# EasyEDA Pro project keyboard_board_pcb.epro

# Board Keyboard_pcb
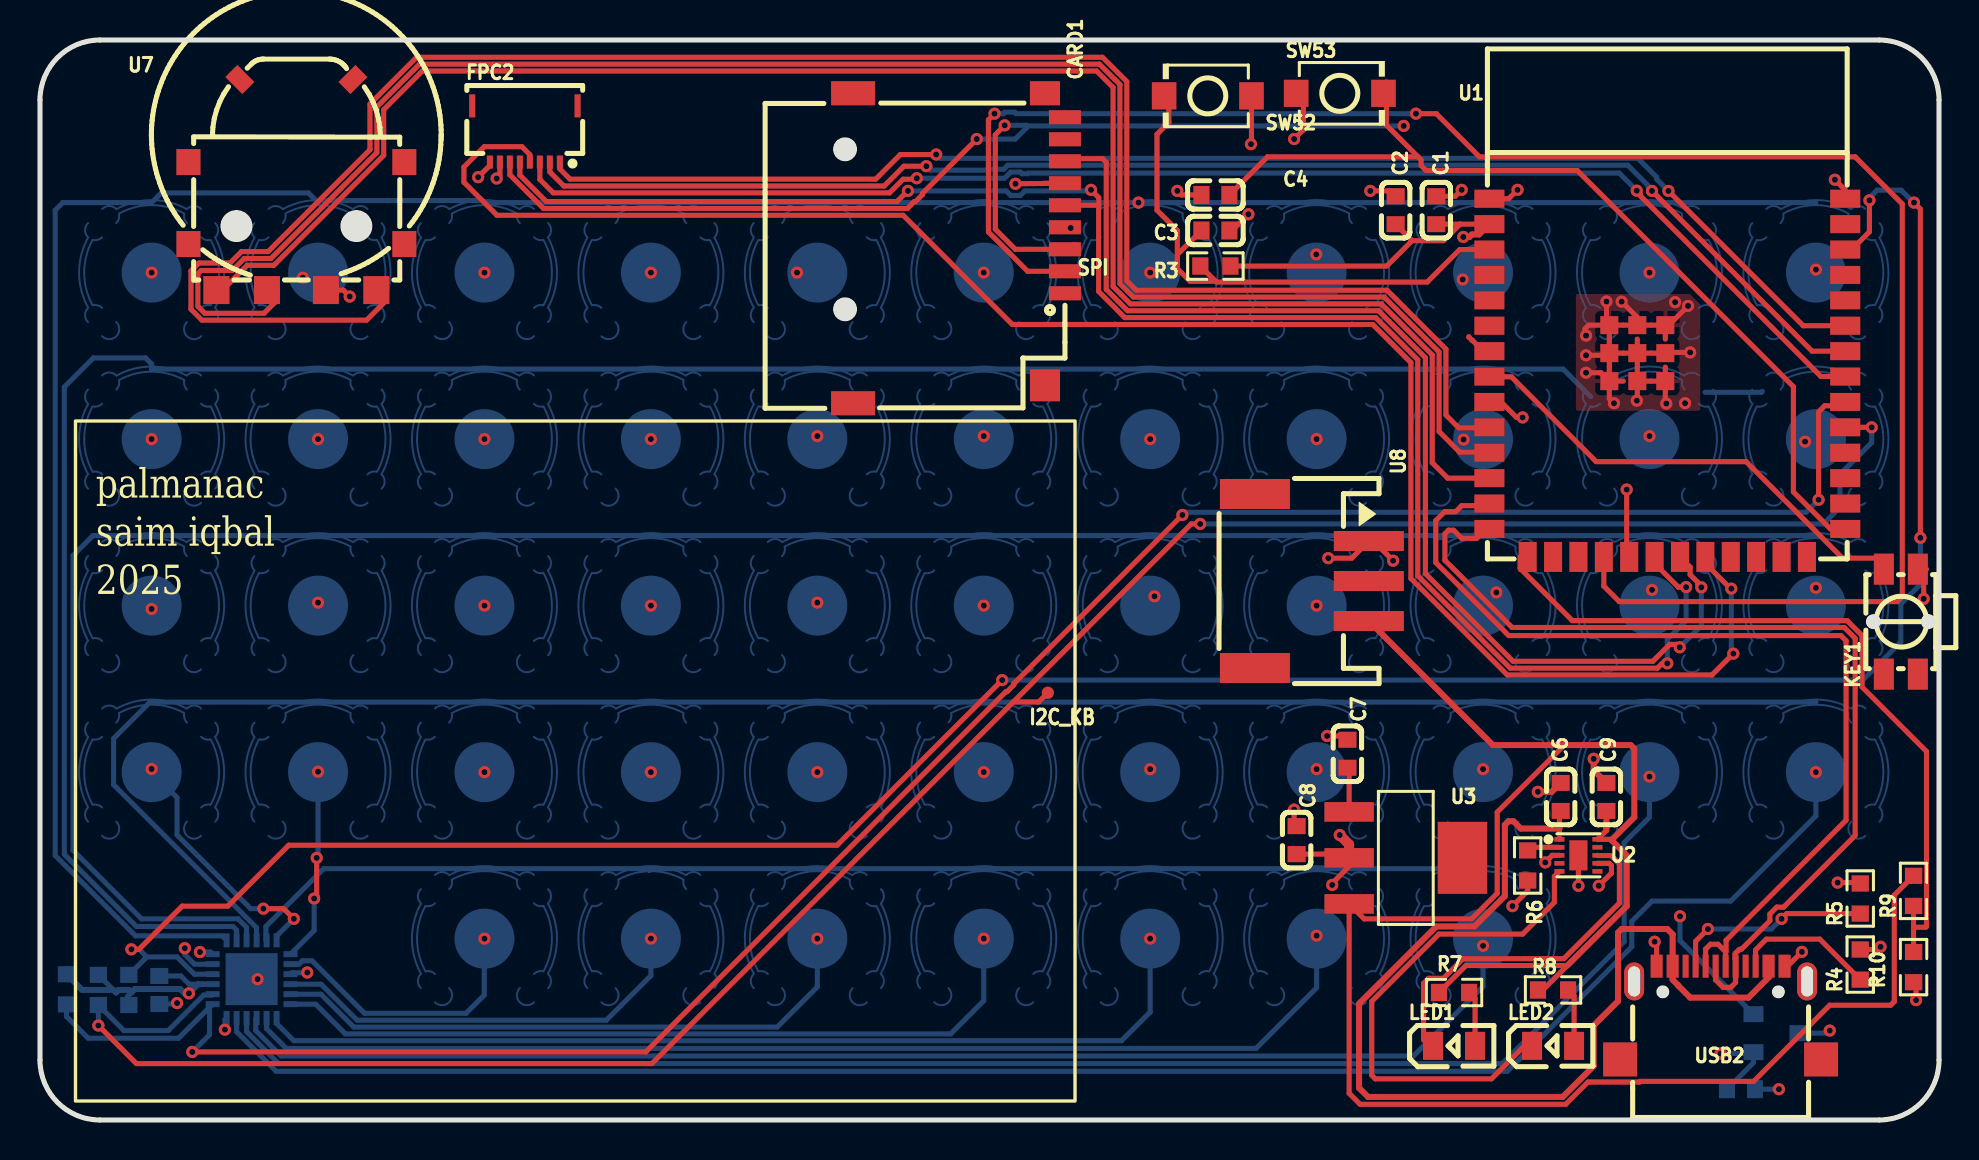
[diagram p0: board, top side]
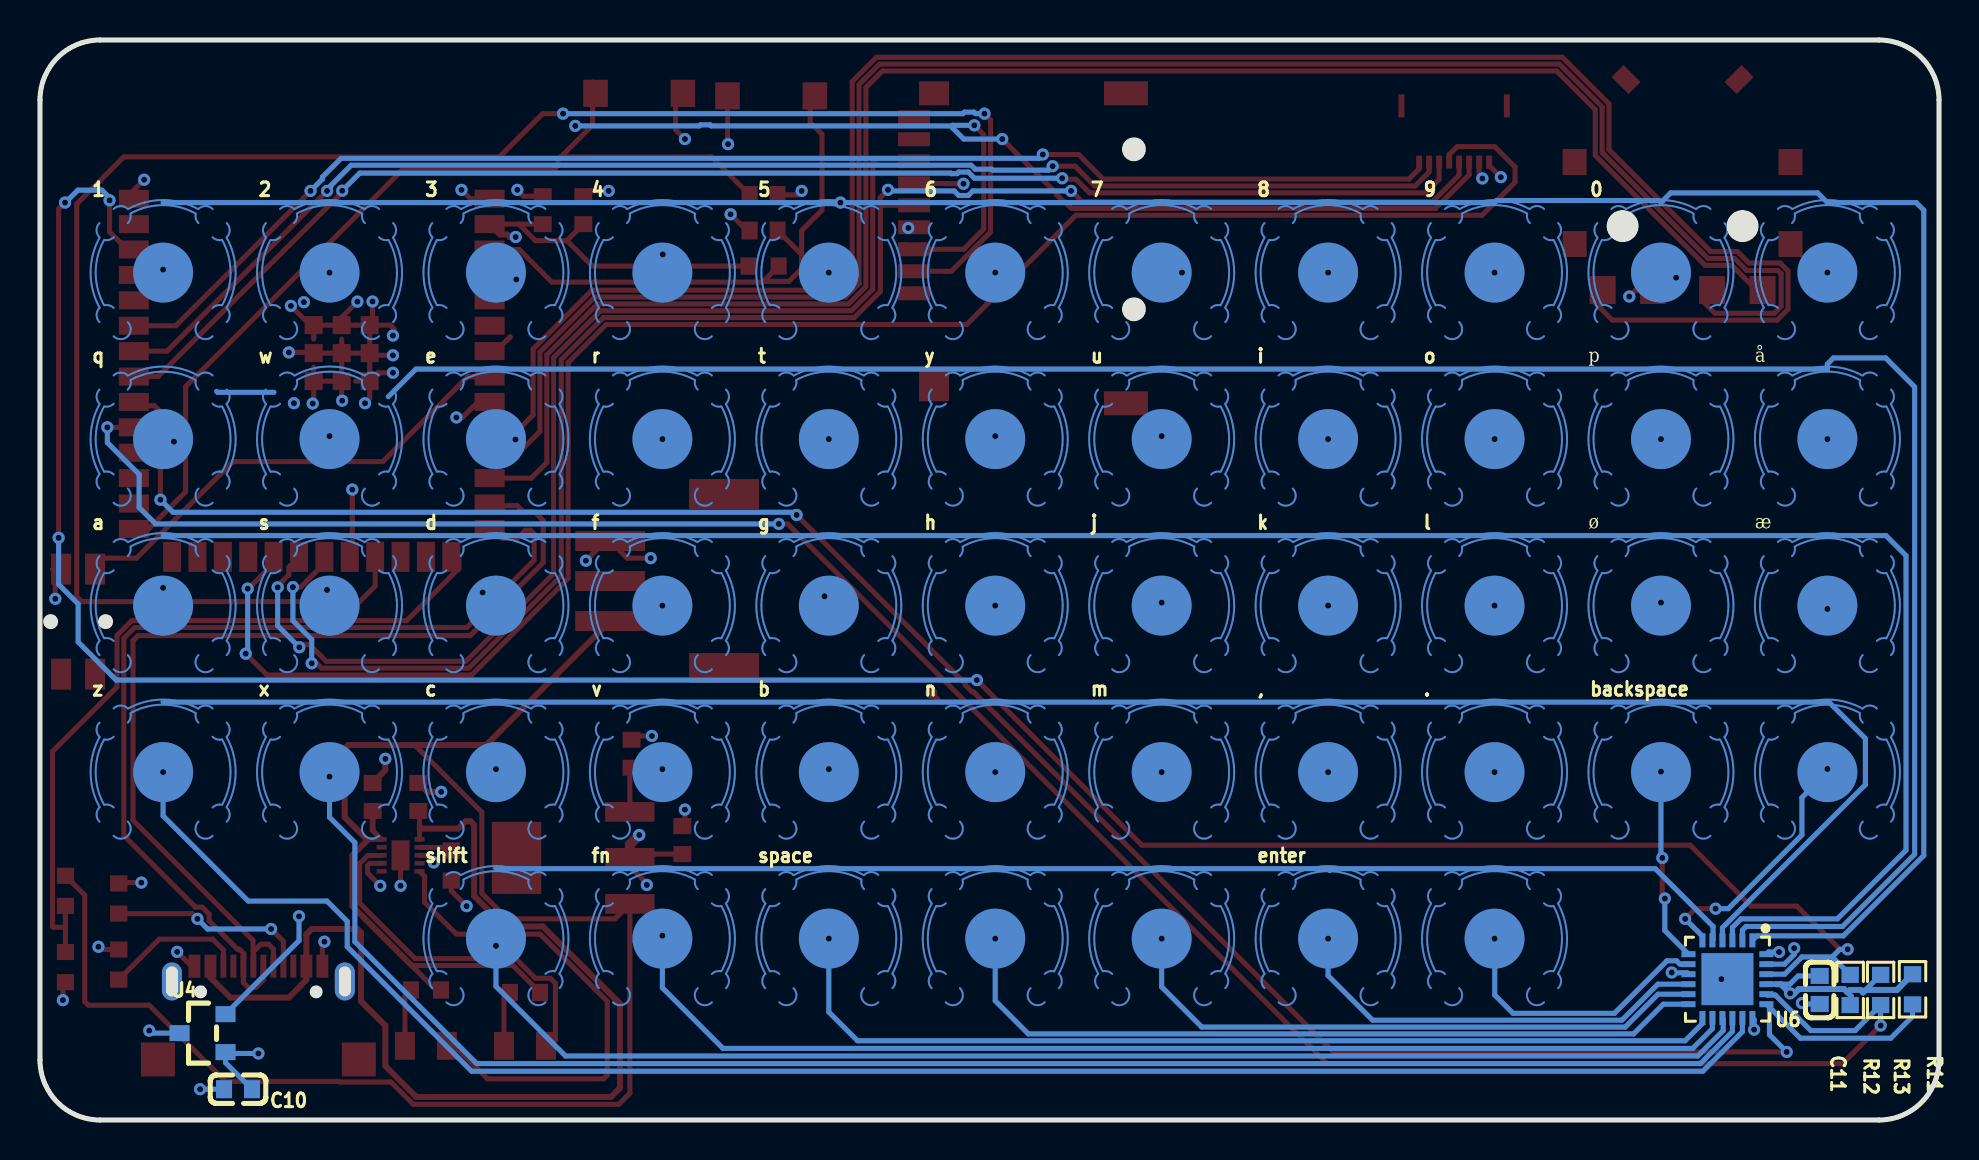
[diagram p1: board, bottom side, seen from below]

Outline 95 x 54 mm; copper layers: Top Layer, Inner1, Inner2, Bottom Layer. Coordinates in mm from the lower left corner of the outline.
Outline path: 0,51 0,3 arc(0.88,0.88) 3,0 92,0 arc(94.12,0.88) 95,3 95,51 arc(94.12,53.12) 92,54 3,54 arc(0.88,53.12) 0,51
Stack: Top Layer 0.035mm Outer layer thickness 1oz / Dielectric1 0.2104mm 7628 RC49% 8.6mil / Inner1 0.0152mm Inner layer thickness / Dielectric2 1.065mm 1.1mm H/HOZ Copper / Inner2 0.0152mm Inner layer thickness / Dielectric3 0.2104mm 7628 RC49% 8.6mil / Bottom Layer 0.035mm Outer layer thickness 1oz

## Design rules (mm)
net USB_D-: USB_D
net USB_D+: USB_D
template: Custom Config
spacing copperThicknessInner0.5oz (default): track to track 0.089, other pairs 0.152 to 0.3
spacing copperThickness1oz: track to track 0.102, other pairs 0.152 to 0.3
spacing copperThickness2oz: track to track 0.203, other pairs 0.152 to 0.3
track width copperThickness1oz: min 0.102, default 0.254, max 2.54
track width copperThickness0.5oz (default): min 0.089, default 0.254, max 2.54
track width copperThickness2oz: min 0.203, default 0.254, max 2.54
differential pair differentialPair (default): width min 0.127, default 0.254, max 2.54; gap min 0.152, default 0.152
via viaSize (default): diameter min 0.3, default 0.61, max 10; hole min 0.2, default 0.305, max 6.3

## Placement (name value [footprint] x y rotation side)
0  -  [Switch_Dome_7MM]  13.91 42.37 180 bottom
1  -  [Switch_Dome_7MM]  88.84 42.37 180 bottom
2  -  [Switch_Dome_7MM]  80.52 42.37 180 bottom
3  -  [Switch_Dome_7MM]  72.19 42.37 180 bottom
4  -  [Switch_Dome_7MM]  63.86 42.37 180 bottom
5  -  [Switch_Dome_7MM]  55.54 42.37 180 bottom
6  -  [Switch_Dome_7MM]  47.21 42.37 180 bottom
7  -  [Switch_Dome_7MM]  38.89 42.37 180 bottom
8  -  [Switch_Dome_7MM]  30.56 42.37 180 bottom
9  -  [Switch_Dome_7MM]  22.24 42.37 180 bottom
,  -  [Switch_Dome_7MM]  30.56 17.39 180 bottom
.  -  [Switch_Dome_7MM]  22.24 17.39 180 bottom
a  -  [Switch_Dome_7MM]  88.84 25.72 180 bottom
b  -  [Switch_Dome_7MM]  55.54 17.39 180 bottom
backspace  -  [Switch_Dome_7MM]  13.91 17.39 180 bottom
c  -  [Switch_Dome_7MM]  72.19 17.39 180 bottom
C1  100nF  [C0603]  69.85 45.49 90 top
C2  10uF  [C0603]  67.82 45.49 90 top
C3  100nF  [C0603]  58.8 44.47 0 top
C4  100nF  [C0603]  58.8 46.25 180 top
C6  1uF  [C0603]  76.07 16.15 90 top
C7  4.7uF  [C0603]  65.4 18.31 270 top
C8  4.7uF  [C0603]  62.86 13.99 270 top
C9  1uF  [C0603]  78.36 16.15 90 top
C10  10uF  [C0603]  85.09 1.54 0 bottom
C11  100nF  [C0603]  5.97 6.5 270 bottom
CARD1  TF PUSH  [TF-SMD_TF-PUSH]  45.97 43.59 270 top
d  -  [Switch_Dome_7MM]  72.19 25.72 180 bottom
e  -  [Switch_Dome_7MM]  72.19 34.05 180 bottom
enter  -  [Switch_Dome_7MM]  30.56 9.07 180 bottom
f  -  [Switch_Dome_7MM]  63.86 25.72 180 bottom
fn  -  [Switch_Dome_7MM]  63.86 9.07 180 bottom
FPC2  HC-FPC-05-10-8RLTAG  [FPC-SMD_8P-P0.50_HCTL_HC-FPC-05-10-8RLTAG]  24.26 49.3 0 top
g  -  [Switch_Dome_7MM]  55.54 25.72 180 bottom
h  -  [Switch_Dome_7MM]  47.21 25.72 180 bottom
i  -  [Switch_Dome_7MM]  30.56 34.05 180 bottom
j  -  [Switch_Dome_7MM]  38.89 25.72 180 bottom
k  -  [Switch_Dome_7MM]  30.56 25.72 180 bottom
KEY1  EVQPUL02K  [KEY-SMD_4P-L4.7-W3.5-P1.70-LS6.4-EH]  93.09 24.92 90 top
l  -  [Switch_Dome_7MM]  22.24 25.72 180 bottom
LED1  NCD0805R1  [LED0805-R-RD]  70.74 3.71 0 top
LED2  NCD0805R1  [LED0805-R-RD]  75.69 3.71 0 top
m  -  [Switch_Dome_7MM]  38.89 17.39 180 bottom
n  -  [Switch_Dome_7MM]  47.21 17.39 180 bottom
NOREF  -  [Pad_e786]  51.75 43.59 0 top
NOREF#2  -  [Pad_e787]  51.75 43.59 0 top
NOREF#3  -  [Pad_e778]  50.42 21.36 0 top
o  -  [Switch_Dome_7MM]  22.24 34.05 180 bottom
p  -  [Switch_Dome_7MM]  13.91 34.05 180 bottom
q  -  [Switch_Dome_7MM]  88.84 34.05 180 bottom
r  -  [Switch_Dome_7MM]  63.86 34.05 180 bottom
R3  10kΩ  [R0603]  58.8 42.7 180 top
R4  5.1kΩ  [R0603]  91.06 7.77 90 top
R5  5.1kΩ  [R0603]  91.06 11.07 90 top
R6  154Ω  [R0603]  74.42 12.72 90 top
R7  1.5kΩ  [R0603]  70.74 6.38 180 top
R8  1.5kΩ  [R0603]  75.69 6.5 180 top
R9  100kΩ  [R0603]  93.73 11.45 90 top
R10  100kΩ  [R0603]  93.73 7.64 90 top
R11  10kΩ  [R0603]  1.32 6.53 90 bottom
R12  10kΩ  [R0603]  2.92 6.5 90 bottom
R13  10kΩ  [R0603]  4.44 6.5 270 bottom
s  -  [Switch_Dome_7MM]  80.52 25.72 180 bottom
shift  -  [Switch_Dome_7MM]  72.19 9.07 180 bottom
space  -  [Switch_Dome_7MM]  55.54 9.07 180 bottom
SW34  -  [Switch_Dome_7MM]  5.58 17.39 180 bottom
SW45  -  [Switch_Dome_7MM]  22.24 9.07 180 bottom
SW47  -  [Switch_Dome_7MM]  38.89 9.07 180 bottom
SW48  -  [Switch_Dome_7MM]  47.21 9.07 180 bottom
SW52  TS-1088-AR02016  [SW-SMD_L3.9-W3.0-P4.45]  58.42 51.21 180 top
SW53  TS-1088-AR02016  [SW-SMD_L3.9-W3.0-P4.45]  65.02 51.33 0 top
t  -  [Switch_Dome_7MM]  55.54 34.05 180 bottom
u  -  [Switch_Dome_7MM]  38.89 34.05 180 bottom
U1  ESP32-S3-WROOM-1-N4  [WIFIM-SMD_ESP32-S3-WROOM-1-N8]  81.41 37.11 0 top
U2  BQ24040DSQT  [WSON-10_L2.0-W2.0-P0.40-TL-EP]  76.96 13.23 0 top
U3  AP7361EA-33ER-13  [SOT-223-4_L6.5-W3.5-P2.30-LS7.0-BR]  68.33 13.11 180 top
U4  DRV5032FBDBZR  [SOT-23_L2.9-W1.3-P1.90-LS2.4-BR]  86.87 4.34 180 bottom
U6  TCA9535RGER  [VQFN-24_L4.0-W4.0-P0.50-BL-EP2.5]  10.58 7.04 0 bottom
U7  SIQ-02FVS3  [SW-SMD_SIQ-02FVS3_1]  12.83 46.76 0 top
U8  XY-PH2.0-3A61  [CONN-SMD_3P-P2.00_HX-2.0-3P-WT]  63.63 26.95 270 top
USB2  GT-USB-7047C  [USB-C-SMD_GT-USB-7047C]  84.07 5.36 0 top
v  -  [Switch_Dome_7MM]  63.86 17.39 180 bottom
w  -  [Switch_Dome_7MM]  80.52 34.05 180 bottom
x  -  [Switch_Dome_7MM]  80.52 17.39 180 bottom
y  -  [Switch_Dome_7MM]  47.21 34.05 180 bottom
z  -  [Switch_Dome_7MM]  88.84 17.39 180 bottom
å  -  [Switch_Dome_7MM]  5.58 42.37 180 bottom
å#2  -  [Switch_Dome_7MM]  5.58 34.05 180 bottom
æ  -  [Switch_Dome_7MM]  5.58 25.72 180 bottom
ø  -  [Switch_Dome_7MM]  13.91 25.72 180 bottom

## Footprints (pads in the part's own frame, mm; a bottom-side part is the same pattern mirrored in y, then rotated)
C0603
  rect 0.8x0.9 smd: 1(-0.7,0) 2(0.7,0)
CONN-SMD_3P-P2.00_HX-2.0-3P-WT
  rect 1x3.5 smd: 1(-2,2.85) 2(0,2.85) 3(2,2.85)
  rect 1.5x3.5 smd: 4(4.35,-2.85) 5(-4.35,-2.85)
FPC-SMD_8P-P0.50_HCTL_HC-FPC-05-10-8RLTAG
  rect 0.3x0.65 smd: 1(1.75,-1.405) 2(1.25,-1.405) 3(0.75,-1.405) 4(0.25,-1.405) 5(-0.25,-1.405) 6(-0.75,-1.405) 7(-1.25,-1.405) 8(-1.75,-1.405)
  rect 0.3x1.15 smd: 9(-2.635,1.405) 10(2.635,1.405)
KEY-SMD_4P-L4.7-W3.5-P1.70-LS6.4-EH
  rect 1.55x1 smd: 1(-2.625,0.85) 2(-2.625,-0.85) 3(2.625,0.85) 4(2.625,-0.85)
LED0805-R-RD
  rect 1x1.399 smd: 1(1.05,0) 2(-1.05,0)
Pad_e778
  round 0.61 smd: TP1(0,0)
Pad_e786
  round 0.61 smd: TP2(0,0)
Pad_e787
  round 0.61 smd: TP3(0,0)
R0603
  rect 0.806x0.864 smd: 1(-0.753,0) 2(0.753,0)
SOT-23_L2.9-W1.3-P1.90-LS2.4-BR
  rect 1x0.8 smd: 1(1.15,-0.95) 2(1.15,0.95) 3(-1.15,0)
SOT-223-4_L6.5-W3.5-P2.30-LS7.0-BR
  rect 2.47x0.98 smd: 1(2.835,-2.3) 2(2.835,0) 3(2.835,2.3)
  rect 2.47x3.6 smd: 4(-2.835,0)
SW-SMD_L3.9-W3.0-P4.45
  rect 1.23x1.36 smd: 1(-2.185,0) 2(2.185,0)
SW-SMD_SIQ-02FVS3_1
  rect 1.2x1.3 smd: 1(5.4,-2.964) 2(5.4,1.136) 5(-5.4,1.136) 6(-5.4,-2.964)
  rect 0.85x1.2 smd rot 135: 3(2.829,5.264)
  rect 0.85x1.2 smd rot 45: 4(-2.829,5.264)
  rect 1.3x1.4 smd: A(-4,-5.264) B(4,-5.264) C(1.475,-5.264) S(-1.475,-5.264)
Switch_Dome_7MM
  round 3 smd: 1(0,0)
  custom 7.254x6.956 smd: 2(0,3.5)
TF-SMD_TF-PUSH
  rect 0.7x1.6 smd: 1(2.25,5.3) 2(1.15,5.3) 3(0.05,5.3) 4(-1.05,5.3) 5(-2.15,5.3) 6(-3.25,5.3) 7(-4.35,5.3) 8(-5.45,5.3) CD(-6.55,5.3)
  rect 1.2x1.5 smd: 10(-7.75,4.3)
  rect 1.2x2.2 smd: 11(-7.75,-5.3) 12(7.75,-5.3)
  rect 1.6x1.5 smd: 13(6.85,4.3)
USB-C-SMD_GT-USB-7047C
  oval 1x1.9 hole 0.6x1.5: 13(-4.325,1.569) 14(4.325,1.569)
  rect 1.7x1.7 smd: 15(-5.025,-2.332) 16(5.025,-2.332)
  rect 0.6x1.15 smd: A1B12(-3.2,2.332) A4B9(-2.4,2.332) B1A12(3.2,2.332) B4A9(2.4,2.332)
  rect 0.3x1.15 smd: A5(-1.25,2.332) A6(-0.25,2.332) A7(0.25,2.332) A8(1.25,2.332) B5(1.75,2.332) B6(0.75,2.332) B7(-0.75,2.332) B8(-1.75,2.332)
VQFN-24_L4.0-W4.0-P0.50-BL-EP2.5
  rect 0.3x0.7 smd: 1(-1.25,-1.942) 2(-0.75,-1.942) 3(-0.25,-1.942) 4(0.25,-1.942) 5(0.75,-1.942) 6(1.25,-1.942) 13(1.25,1.942) 14(0.75,1.942) 15(0.25,1.942) 16(-0.25,1.942) 17(-0.75,1.942) 18(-1.25,1.942)
  rect 0.7x0.3 smd: 7(1.948,-1.25) 8(1.948,-0.75) 9(1.948,-0.25) 10(1.948,0.25) 11(1.948,0.75) 12(1.948,1.25) 19(-1.948,1.25) 20(-1.948,0.75) 21(-1.948,0.25) 22(-1.948,-0.25) 23(-1.948,-0.75) 24(-1.948,-1.25)
  rect 2.6x2.6 smd: 25(0.001,-0.001)
WIFIM-SMD_ESP32-S3-WROOM-1-N8
  rect 1.5x0.9 smd: 1(-8.9,8.954) 2(-8.9,7.684) 3(-8.9,6.415) 4(-8.9,5.144) 5(-8.9,3.874) 6(-8.9,2.604) 7(-8.9,1.335) 8(-8.9,0.065) 9(-8.9,-1.206) 10(-8.9,-2.475) 11(-8.9,-3.745) 12(-8.9,-5.016) 13(-8.9,-6.285) 14(-8.9,-7.556) 27(8.9,-7.556) 28(8.9,-6.285) 29(8.9,-5.016) 30(8.9,-3.745) 31(8.9,-2.475) 32(8.9,-1.206) 33(8.9,0.065) 34(8.9,1.335) 35(8.9,2.604) 36(8.9,3.874) 37(8.9,5.144) 38(8.9,6.415) 39(8.9,7.684) 40(8.9,8.954)
  rect 0.9x1.5 smd: 15(-6.985,-8.954) 16(-5.715,-8.954) 17(-4.445,-8.954) 18(-3.175,-8.954) 19(-1.905,-8.954) 20(-0.635,-8.954) 21(0.635,-8.954) 22(1.905,-8.954) 23(3.175,-8.954) 24(4.445,-8.954) 25(5.715,-8.954) 26(6.985,-8.954)
  rect 0.9x0.9 smd: 41(-2.9,2.635) 41(-2.9,1.235) 41(-2.9,-0.165) 41(-1.5,2.635) 41(-1.5,1.235) 41(-1.5,-0.165) 41(-0.1,2.635) 41(-0.1,1.235) 41(-0.1,-0.165)
WSON-10_L2.0-W2.0-P0.40-TL-EP
  rect 0.505x0.224 smd: 1(-0.95,0.8) 2(-0.95,0.4) 3(-0.95,0) 4(-0.95,-0.4) 5(-0.95,-0.8) 6(0.95,-0.8) 7(0.95,-0.4) 8(0.95,0) 9(0.95,0.4) 10(0.95,0.8)
  rect 0.9x1.5 smd: 11(0,0)

## Nets
3V3: C1.1 C2.1 C8.2 C10.1 C11.1 CARD1.4 FPC2.8 R3.1 R11.2 R12.2 R13.2 U1.2 U3.2 U4.1 U6.21
GND: C1.2 C2.2 C3.2 C4.2 C6.2 C7.1 C8.1 C9.2 C10.2 C11.2 CARD1.6 FPC2.7 KEY1.4 R4.2 R5.2 R6.1 R10.1 SW52.1 SW53.1 U1.1 U1.40 U1.41 U2.3 U2.7 U2.11 U4.3 U6.9 U6.18 U6.23 U6.24 U6.25 U7.C U8.1 USB2.A1B12 USB2.B1A12
BAT+: C9.1 R7.2 R8.2 R9.2 U2.10 U3.3 U8.3
BAT_MEAS: R9.1 R10.2 U1.15
BOOT: C4.1 SW53.2 U1.27
BUSY: FPC2.1 U1.35
COL1: SW34.1 U6.6 å.1 å#2.1 æ.1
COL2: 0.1 backspace.1 p.1 U6.7 ø.1
COL3: 9.1 ..1 l.1 o.1 SW45.1 U6.8
COL4: 8.1 ,.1 enter.1 i.1 k.1 U6.10
COL5: 7.1 j.1 m.1 SW47.1 u.1 U6.11
COL6: 6.1 h.1 n.1 SW48.1 U6.12 y.1
COL7: 5.1 b.1 g.1 space.1 t.1 U6.13
COL8: 4.1 f.1 fn.1 r.1 U6.14 v.1
COL9: 3.1 c.1 d.1 e.1 shift.1 U6.15
COL10: 2.1 s.1 U6.16 w.1 x.1
COL11: 1.1 a.1 q.1 U6.17 z.1
D/C: FPC2.3 U1.33
EN: C3.1 R3.2 SW52.2 U1.3
HINGESENSOR: U1.9 U4.2
I2C_SCL: R11.1 U1.32 U6.19
I2C_SDA: NOREF#3.TP1 R12.1 U1.31 U6.20
INT: R13.1 U1.38 U6.22
RES: FPC2.2 U1.34
ROW1: 0.2 1.2 2.2 3.2 4.2 5.2 6.2 7.2 8.2 9.2 U6.1 å.2
ROW2: e.2 i.2 o.2 p.2 q.2 r.2 t.2 u.2 U6.2 w.2 y.2 å#2.2
ROW3: a.2 d.2 f.2 g.2 h.2 j.2 k.2 l.2 s.2 U6.3 æ.2 ø.2
ROW4: ,.2 ..2 b.2 backspace.2 c.2 m.2 n.2 SW34.2 U6.4 v.2 x.2 z.2
ROW5: enter.2 fn.2 shift.2 space.2 SW45.2 SW47.2 SW48.2 U6.5
SLEEPBUTTON: KEY1.3 U1.8
SPI_CLK: CARD1.5 FPC2.5 U1.20
SPI_CS1: CARD1.2 U1.18
SPI_CS2: FPC2.4 U1.22
SPI_MISO: CARD1.7 U1.21
SPI_MOSI: CARD1.3 FPC2.6 NOREF.TP2 NOREF#2.TP3 U1.19
USB_5V: C6.1 U2.1 USB2.A4B9 USB2.B4A9
USB_D+: U1.14 USB2.A6 USB2.B6
USB_D-: U1.13 USB2.A7 USB2.B7
WHEEL_A: U1.12 U7.A
WHEEL_B: U1.10 U7.B
WHEEL_SWITCH: U1.11 U7.S
$1N4205: R4.1 USB2.B5
$1N4231: R5.1 USB2.A5
$1N6760: LED1.1 R7.1
$1N6829: LED1.2 U2.8
$1N6901: LED2.1 R8.1
$1N6931: LED2.2 U2.5
$1N6964: R6.2 U2.2
$1N6989: C7.2 U3.1

Pads without a net: CARD1 1 8 10 11 12 13 CD; FPC2 9 10; KEY1 1 2; U1 4 5 6 7 16 17 23 24 25 26 28 29 30 36 37 39; U2 4 6 9; U3 4; U7 1 2 3 4 5 6; U8 2 4 5; USB2 13 14 15 16 A8 B8

## Via types
v1: diameter 0.61, hole 0.305, Top Layer to Bottom Layer, 145 vias

## Routing (per net, layer and track width the routed paths; a pad name or vN(x,y) marks a point on that pad's centre or on a via; arc(x,y) is an arc through that point)
3V3: length 223.8
  Top Layer w0.254: 59.55,42.7 67.37,42.7 68.64,43.97 ; v1(64.64,11.75) 64.64,11.84 65.49,12.68 U3.2 65.3,13.3 C8.2 ; 68.64,43.97 C2.1 ; 68.64,43.97 70.22,43.97 71.04,44.79 ; v1(21.92,47.14) 22.51,47.73 FPC2.8 ; C1.1 69.85,44.79 71.04,44.79 ; 71.04,44.79 72.13,44.79
  Top Layer w0.3: v1(71.2,44.15) 71.51,44.15 71.63,44.28 71.99,44.28 U1.2
  Top Layer w0.5: v1(65.02,14.25) 65.49,13.78 U3.2
  Inner2 w0.254: v1(64.64,11.75) 73.07,3.33 ; 73.15,3.33 v1(84.07,3.33)
  Inner2 w0.3: 64.01,43.97 25.09,43.97 v1(21.92,47.14) ; 64.01,43.97 63.37,44.6 v1(51.56,44.6) ; 64.01,43.97 64.02,43.97 65.09,42.9 ; 65.15,42.95 65.16,42.95 65.16,42.83 65.15,42.82 65.09,42.89 65.15,42.95 ; 65.15,42.95 66.35,44.15 v1(71.2,44.15) ; v1(7.45,6.33) 7.45,6.11 7.46,6.1 7.46,5.6 7.45,5.58 7.45,5.15 9.27,3.33 73.15,3.33
  Inner2 w0.5: 65.15,42.82 65.15,35.46 65.15,35.46 65.15,14.38 v1(65.02,14.25)
  Bottom Layer w0.254: 7.91,6.79 7.46,6.79 7.05,7.2 C11.1 ; R12.2 3.67,6.5 ; R13.2 4.39,5.8 4.39,6.2 4.57,6.38 ; v1(84.07,3.33) 85.65,3.33 U4.1 85.72,2.87 C10.1 ; 8.16,6.79 U6.21
  Bottom Layer w0.3: R11.2 2.11,6.5 3.67,6.5 3.8,6.38 3.93,6.5 4.44,6.5 4.57,6.38 4.75,6.55 7.01,6.55 7.23,6.33 v1(7.45,6.33) 7.91,6.79 8.16,6.79
GND: length 75.1
  Top Layer w0.254: v1(62.74,15.52) 62.74,14.82 C8.1 ; U1.41 78.51,37.64 ; U1.41 78.51,36.07 v1(78.74,35.84) ; U1.41 78.09,37.36 v1(77.34,37.36) ; U1.41 79.21,36.94 ; U1.41 77.47,39.74 77.29,39.56 77.29,39.27 v1(77.34,39.22) ; U1.41 U1.41 ; U1.41 78.36,39.89 v1(78.36,40.92) ; U1.41 78.51,39.04 ; C3.2 59.64,44.47 v1(60.45,45.29) ; FPC2.7 23.01,47.24 v1(22.84,47.08) ; v1(67.69,27.96) 66.71,28.95 U8.1 65.62,28.09 v1(64.45,28.09) ; U1.41 U1.41 ; U1.41 81.31,35.87 v1(81.36,35.82) ; U1.41 81.31,37.64 ; R4.2 91.94,8.53 v1(92.08,8.66) ; U1.41 U1.41 ; U1.41 79.91,40.13 v1(79.12,40.92) ; v1(88.14,8.41) 87.42,7.69 USB2.B1A12 ; v1(71.12,46.51) 70.8,46.19 C1.2 ; USB2.A1B12 80.87,8.81 v1(80.77,8.91) ; U1.41 79.91,37.64 ; U1.41 U1.41 ; U1.41 79.91,39.04 ; U1.41 U1.41 81.34,38.38 v1(82.55,38.38) ; C2.2 67.55,46.45 v1(66.55,46.45) ; SW53.1 63.2,50.97 63.2,49.51 v1(62.74,49.05) ; v1(79.88,35.97) 79.91,35.99 U1.41 ; C4.2 57.1,46.25 v1(56.9,46.45) ; v1(73.91,46.51) 73.47,46.06 U1.1 ; v1(94.23,26.06) 94.23,27.4 94.37,27.54 ; v1(73.66,10.69) 74.42,11.45 R6.1 ; R10.1 93.85,6.76 v1(93.85,5.99) ; v1(82.45,40.7) 81.49,39.74 U1.41 ; U1.41 78.4,38.24 v1(77.34,38.24) ; U1.41 78.51,37.64 ; U1.41 78.51,39.04 ; v1(60.58,48.79) 60.61,48.82 SW52.1 ; U2.7 78.5,12.83 78.61,12.72 78.61,12.34 v1(77.98,11.71) ; v1(89.93,11.87) 91.02,11.87 R5.2 ; v1(64.39,19.2) 65.22,19.2 C7.1 ; U1.41 81.31,39.04 ; U1.40 90.31,46.5 v1(89.79,47.02) ; U1.41 79.91,37.64 ; v1(75.3,12.88) 75.48,13.06 75.48,13.06 75.64,13.22 75.65,13.22 75.66,13.23 U2.3 ; 50.26,46.84 51.27,46.84 v1(48.8,46.81) ; U2.11 v1(76.96,11.71) ; v1(15.49,41.17) 15.17,41.5 14.81,41.5
  Top Layer w0.3: C6.2 75.63,16.41 v1(74.93,16.41) ; C9.2 77.72,17.49 v1(77.72,18.06)
  Bottom Layer w0.254: U6.23 7.73,7.79 7.25,8.27 v1(7.25,8.59) ; C11.2 6.81,5.8 v1(6.86,5.85) ; U6.24 8.53,8.4 v1(8,8.4) ; v1(89.53,4.47) 89.41,4.34 U4.3 ; C10.2 v1(86.99,1.54) ; v1(9.25,4.52) 9.25,5.02 U6.18 ; v1(13.37,7.38) 13.36,7.36 12.6,7.36 U6.9
  vias: v1(10.88,7.04) v1(81.8,40.89) v1(82.3,35.84)
(no net): length 1.3
  Top Layer w0.254: U1.7 72.25,38.7 71.94,38.7 71.66,38.98 71.64,38.98 71.48,39.15 71.48,39.16
BAT+: length 102.9
  Top Layer w0.254: R9.2 92.76,11.24 92.76,5.92 92.58,5.74 89.53,5.74 85.73,1.93 80.05,1.93 80.01,1.9 77.44,1.9 76.33,0.79 66.04,0.79 65.49,1.34 U3.3 66.24,10.06 71.62,10.06 72.9,11.34 72.9,15.39 76.25,18.75 ; 78.36,14.48 U2.10 78.58,14.03 78.61,13.99 ; R8.2 75.18,6.5 76.41,7.72 71.33,7.72 R7.2
  Top Layer w0.3: 76.41,7.72 79.37,10.69 79.37,13.23 78.61,13.99 79.76,15.14 79.76,18.57 79.58,18.75 72.68,18.75 U8.3 ; 78.36,14.48 C9.1
BAT_MEAS: length 37.9
  Top Layer w0.254: 74.04,28.15 74.04,27.58 76.66,24.97 90.4,24.97 91.15,24.22 91.15,21.65 94.37,18.43 94.37,9.68 94.34,9.64 93.73,9.64 ; R10.2 93.73,9.64 ; 93.73,9.64 R9.1
BOOT: length 46.6
  Top Layer w0.254: 89.93,29.55 89.57,29.55 87.72,31.41 87.72,36.66 76.91,47.47 69.34,47.47 69.09,47.73 69.09,48.01 68.94,48.16 ; 68.94,48.16 67.35,49.75 67.36,49.76 67.36,51.9 ; 68.94,48.16 61.41,48.16 C4.1
BUSY: length 69
  Top Layer w0.254: U1.35 88.21,39.71 v1(81.46,46.45) ; FPC2.1 26.01,47.55 26.52,47.04 41.81,47.04 43.04,48.27 44.83,48.27
  Bottom Layer w0.254: v1(44.83,48.28) 45.03,48.08 79.94,48.08 80.87,47.15 80.87,47.05 v1(81.46,46.45)
COL1: length 37.5
  Top Layer w0.254: v1(12.7,10.06) 12.19,10.57 v1(11.18,10.57)
  Inner2 w0.254: v1(5.58,42.37) v1(5.58,34.05) v1(5.58,25.55) v1(5.58,17.55)
  Bottom Layer w0.254: U6.6 11.83,9.19 v1(12.7,10.06) ; SW34.1 6.86,16.12 6.86,14.25 10.54,10.57 v1(11.18,10.57)
COL2: length 34.7
  Top Layer w0.254: v1(13.72,11.07) 13.84,11.2 v1(13.84,13.11)
  Inner2 w0.254: v1(13.91,17.42) v1(13.91,25.87) v1(13.91,34.05) 13.15,34.81 v1(13.15,42.12)
  Bottom Layer w0.254: v1(13.72,11.07) 13.72,9.47 U6.7 ; v1(13.84,13.11) 13.91,13.17 backspace.1
COL3: length 47.4
  Inner2 w0.254: v1(22.24,42.37) v1(22.24,34.05) v1(22.24,25.72) v1(22.24,17.39) v1(22.24,9.07)
  Bottom Layer w0.254: v1(22.24,9.07) 22.22,9.06 22.22,6.25 21.31,5.33 16.24,5.33 13.61,7.96 13.13,7.96 12.96,7.79 U6.8
COL4: length 54.8
  Inner2 w0.254: v1(30.56,42.37) v1(30.56,34.05) v1(30.56,25.72) v1(30.56,17.39) v1(30.56,9.07)
  Bottom Layer w0.254: v1(30.56,9.07) 30.56,7.22 28.33,4.99 15.86,4.99 14.06,6.79 U6.10
COL5: length 64.2
  Inner2 w0.254: v1(38.89,9.07) v1(38.89,17.39) v1(38.89,25.87) v1(38.89,34.19) 38.51,34.19 37.87,34.83 37.87,42.37 v1(37.87,42.37)
  Bottom Layer w0.254: U6.11 14.05,6.29 15.7,4.65 36.88,4.65 38.89,6.65 v1(38.89,9.07)
COL6: length 72.4
  Inner2 w0.254: v1(47.21,9.07) v1(47.21,17.39) v1(47.21,25.72) v1(47.21,34.19) v1(47.21,42.37)
  Bottom Layer w0.254: U6.12 13.79,5.79 15.28,4.3 45.55,4.3 47.21,5.96 v1(47.21,9.07)
COL7: length 82.1
  Inner2 w0.254: v1(55.54,9.07) v1(55.54,17.54) 55.54,25.97 v1(55.75,26.19) 55.75,33.83 v1(55.54,34.05) v1(55.54,42.37)
  Bottom Layer w0.254: U6.13 11.83,4.83 12.7,3.96 54.1,3.96 55.54,5.4 v1(55.54,9.07)
COL8: length 91.3
  Inner2 w0.254: v1(63.85,43.28) 63.85,34.06 v1(63.86,34.05) v1(63.86,25.72) v1(63.86,17.54) v1(63.86,9.22)
  Bottom Layer w0.254: fn.1 63.86,6.61 60.83,3.58 12.32,3.58 11.33,4.56 U6.14
COL9: length 100.7
  Inner2 w0.254: v1(71.17,42.03) 71.22,41.98 v1(71.22,34.02) 71.22,28.02 v1(72.86,26.38) 72.19,25.71 v1(72.19,17.54) v1(72.19,8.71)
  Bottom Layer w0.254: shift.1 v1(72.19,8.71) 72.19,6.68 68.71,3.2 12.06,3.2 10.8,4.47 10.8,5.06 U6.15
COL10: length 110.9
  Inner2 w0.254: v1(80.52,42.37) 81.61,42.37 83.57,40.41 83.57,36.09 81.67,34.19 v1(80.52,34.19) 80.64,34.07 v1(80.64,26.5) 80.64,17.3 v1(80.52,17.17)
  Bottom Layer w0.254: U6.16 10.33,4.42 11.94,2.82 73.15,2.82 79.25,8.91 79.25,13.87 80.52,15.13 x.1
COL11: length 114.3
  Inner2 w0.254: v1(88.84,42.52) 88.3,41.98 v1(88.3,33.92) 88.3,27.15 v1(88.84,26.61) v1(88.84,17.39)
  Bottom Layer w0.254: U6.17 9.83,4.41 11.81,2.44 73.41,2.44 79.63,8.66 79.63,9.93 80.64,10.95 84.58,10.95 88.84,15.21 v1(88.84,17.39)
D/C: length 71.2
  Top Layer w0.254: v1(79.88,46.46) 80.06,46.29 80.06,46.21 89.09,37.17 U1.33 ; v1(43.86,47.09) 43.81,47.04 43.18,47.04 42.5,46.36 25.68,46.36 25.01,47.03 FPC2.3
  Bottom Layer w0.254: v1(79.88,46.46) 79.88,46.47 79,47.34 49.44,47.34 49.41,47.32 49.12,47.32 49.04,47.4 48.56,47.4 48.25,47.09 v1(43.86,47.09)
EN: length 28.4
  Top Layer w0.254: 72.12,43.52 71.02,43.52 69.4,41.9 58.85,41.9 58.81,41.94 ; 56.9,43.27 C3.1 ; 56.9,43.27 56.9,42.57 57.53,41.94 58.81,41.94 ; 56.9,43.27 56.9,44.47 55.88,45.49 55.88,49.29 56.47,49.88 56.47,51.03 56.29,51.21 SW52.2 ; R3.2 58.81,41.94
HINGESENSOR: length 36.6
  Top Layer w0.254: v1(74.17,35.13) 73.86,35.13 73.09,35.9 U1.9
  Inner2 w0.254: v1(74.17,35.13) 78.61,30.68 78.61,17.17 82.04,13.74 v1(82.04,10.19)
  Bottom Layer w0.254: U4.2 82.04,8.97 v1(82.04,10.19)
I2C_SCL: length 110.4
  Top Layer w0.254: U1.32 90.11,35.71 89.28,35.71 88.97,35.41 v1(88.97,31.01) ; v1(7.62,3.4) 30.3,3.4 48.31,21.41 48.37,21.41 48.72,21.75 48.72,21.82 v1(57.15,30.25)
  Bottom Layer w0.254: 8.48,5.64 8.48,4.27 v1(7.62,3.4) ; 8.48,5.64 6.93,4.09 2.41,4.09 1.32,5.18 R11.1 ; 8.48,5.64 U6.19 ; v1(57.15,30.25) 57.29,30.39 88.35,30.39 v1(88.97,31.01)
I2C_SDA: length 115.4
  Top Layer w0.254: 48.69,20.9 49.96,20.9 NOREF#3.TP1 ; 48.69,20.9 30.61,2.82 4.83,2.82 v1(2.92,4.72) ; 48.69,20.9 57.59,29.8 v1(58.04,29.8) ; 91.63,34.63 U1.31
  Bottom Layer w0.254: v1(91.63,34.63) 91.63,33.87 90.04,32.28 90.04,30.63 89.21,29.8 v1(58.04,29.8) ; v1(2.92,4.72) R12.1 4.2,4.47 6.41,4.47 8.19,6.25 8.59,6.25 U6.20
INT: length 129.2
  Top Layer w0.254: v1(48.13,22) 39.88,13.74 12.45,13.74 9.4,10.69 7.11,10.69 4.95,8.53 v1(4.57,8.53) ; v1(91.52,45.98) 91.52,44.41 90.63,43.52 U1.38 ; v1(94.07,29.11) 94.07,45.55 v1(93.75,45.87)
  Bottom Layer w0.254: v1(91.52,45.98) 91.52,46.11 91.9,46.49 93.11,46.49 93.73,45.87 v1(93.75,45.87) ; v1(48.13,22) 91.19,22 93.09,23.9 93.09,25.81 94.07,26.78 v1(94.07,29.11) ; 5.34,8.15 6.86,8.15 7.72,7.29 U6.22 ; 5.34,8.15 4.96,8.53 v1(4.57,8.53) ; 5.34,8.15 R13.1
RES: length 70.1
  Top Layer w0.254: U1.34 88.65,38.44 v1(80.64,46.45) ; v1(44.34,47.69) 43.22,47.69 42.23,46.7 26.21,46.7 25.51,47.4 FPC2.2
  Bottom Layer w0.254: v1(44.34,47.69) 44.54,47.49 47.35,47.49 47.4,47.54 48.22,47.54 48.42,47.74 79.43,47.74 80.46,46.71 80.46,46.63 v1(80.64,46.45)
ROW1: length 131.3
  Bottom Layer w0.254: 0.2 13.43,46.35 6.07,46.35 å.2 1.14,45.87 0.76,45.49 0.76,13.23 4.78,9.21 9.11,9.21 U6.1 ; 13.91,45.87 14.01,45.97 22.13,45.97 9.2 8.2 7.2 6.2 v1(54.95,45.87) 5.2 4.2 3.2 2.2 1.2
ROW2: length 114.9
  Bottom Layer w0.254: 86.16,36.43 86.11,36.38 83.3,36.38 ; 77.57,36.17 76.2,37.55 e.2 r.2 t.2 y.2 u.2 i.2 o.2 p.2 å#2.2 5.58,37.8 5.28,38.1 2.67,38.1 1.22,36.65 1.22,13.28 4.83,9.68 9.65,9.68 9.83,9.49 U6.2
ROW3: length 113.3
  Bottom Layer w0.254: a.2 s.2 d.2 f.2 g.2 h.2 j.2 k.2 l.2 ø.2 æ.2 2.65,29.22 1.65,28.22 1.65,13.49 5.08,10.06 9.91,10.06 10.33,9.63 U6.3
ROW4: length 99
  Bottom Layer w0.254: U6.4 10.83,9.61 3.68,16.77 3.68,19.07 5.5,20.89 SW34.2 backspace.2 ..2 ,.2 m.2 n.2 b.2 v.2 c.2 x.2 z.2
ROW5: length 62.9
  Bottom Layer w0.254: enter.2 SW45.2 14.19,12.57 11.3,9.68 11.3,9.02 U6.5 ; shift.2 fn.2 space.2 SW48.2 SW47.2 30.58,12.57 ; 30.57,12.56 30.48,12.47
SLEEPBUTTON: length 24.2
  Top Layer w0.254: 72.13,37.17 72.14,37.16 73.61,37.16 77.85,32.92 85.35,32.92 90.17,28.09 91.86,28.09 92.24,27.71 KEY1.3
SPI_CLK: length 86.4
  Top Layer w0.254: v1(52.58,46.51) 52.97,46.12 52.97,45.74 ; v1(82.35,26.64) 81.96,26.64 80.77,27.83 U1.20 ; 52.97,45.74 52.96,45.73 52.96,41.43 54.27,40.12 66.82,40.12 68.92,38.01 68.92,27.22 73.55,22.59 80.91,22.59 81.15,22.83 v1(81.41,22.83) ; 52.97,45.74 51.27,45.74 ; v1(43.42,46.45) 43.4,46.45 42.87,45.92 25.33,45.92 24.01,47.24 FPC2.5
  Bottom Layer w0.254: v1(81.41,22.83) 81.41,24.03 82.35,24.97 82.35,26.64 ; v1(43.42,46.45) 48.33,46.45 48.56,46.23 49.04,46.23 49.27,46.45 52.53,46.45 v1(52.58,46.51)
SPI_CS1: length 94.5
  Top Layer w0.254: v1(47.75,50.32) 47.45,50.01 47.45,44.4 49.41,42.44 51.27,42.44 ; v1(68.83,50.32) 69.85,50.32 72.01,48.16 90.8,48.16 93.16,45.8 93.16,26.17 92.91,25.92 79.01,25.92 78.23,26.69 U1.18
  Bottom Layer w0.254: v1(47.75,50.32) 48.2,50.32 48.27,50.39 48.76,50.39 48.83,50.32 v1(68.83,50.32)
SPI_CS2: length 90.9
  Top Layer w0.254: FPC2.4 24.51,48.27 24.11,48.67 22.22,48.67 21.21,47.65 21.21,46.89 22.86,45.24 43.18,45.24 48.64,39.78 66.67,39.78 68.58,37.87 68.58,27.08 73.41,22.25 83.64,22.25 v1(84.71,23.32) ; v1(84.61,26.57) 84.57,26.57 83.31,27.83 U1.22
  Bottom Layer w0.254: v1(84.61,26.57) 84.61,23.42 v1(84.71,23.32)
SPI_MISO: length 57.1
  Top Layer w0.254: v1(82.03,23.64) 81.88,23.78 81.53,23.78 80.68,22.94 73.69,22.94 69.3,27.32 69.3,38.12 66.96,40.46 54.41,40.46 53.34,41.53 53.34,47.88 53.16,48.06 51.4,48.06 51.27,47.94 ; U1.21 82.55,27.65 82.55,27.27 82.93,26.88 82.93,26.81 v1(83.11,26.63)
  Bottom Layer w0.254: v1(82.03,23.64) 83.11,24.72 v1(83.11,26.63)
SPI_MOSI: length 85.3
  Top Layer w0.254: v1(79.37,31.52) 79.37,28.28 U1.19 ; NOREF.TP2 51.7,43.54 48.8,43.54 47.79,44.54 47.79,49.26 v1(48.26,49.73) ; v1(46.86,49.05) 44.14,46.33 44.14,46.27 43.8,45.92 43.74,45.92 43.4,45.58 25.18,45.58 23.51,47.26 FPC2.6
  Inner2 w0.254: v1(79.37,31.52) 74.42,36.47 74.42,44.03 68.75,49.7 v1(68.22,49.7)
  Bottom Layer w0.254: v1(48.26,49.73) 49.35,49.73 ; 49.35,49.73 49.38,49.7 61.43,49.7 61.48,49.76 61.96,49.76 62.02,49.7 v1(68.22,49.7) ; 49.35,49.73 49.35,49.61 48.79,49.05 v1(46.86,49.05)
USB_5V: length 52.8
  Top Layer w0.254: C6.1 76.01,15.39 U2.1
  Top Layer w0.3: USB2.B4A9 86.49,7.68 86.49,7.14 85.47,6.12 82.55,6.12 81.96,6.71 81.96,6.73 81.67,7.01 USB2.A4B9 81.67,9.28 81.41,9.55 79.12,9.55 78.94,9.37 78.94,5.94 77.72,4.72 77.72,2.7 76.18,1.15 66.44,1.15 65.99,1.6 65.99,5.81 69.85,9.68 71.75,9.68 73.28,11.2 73.28,14.76 73.46,14.94 73.71,14.94 74.08,14.57 76.01,14.57
USB_D+: length 47.8
  Top Layer w0.254: 72.13,29.55 72.13,29.34 71.87,29.08 71.12,29.08 70.72,29.49 70.46,29.49 70.28,29.31 70.28,27.99 73.64,24.63 90.26,24.63 90.8,24.08 90.8,14.22 87.22,10.64 86.88,10.64 86.54,10.3 86.54,9.96 85.12,8.54 85.06,8.54 85.02,8.5 84.98,8.5 84.8,8.32 84.8,8.07 84.82,8.05 USB2.B6 84.82,6.87 84.58,6.63 84.2,6.63 83.82,7.01 USB2.A6
USB_D-: length 47.8
  Top Layer w0.254: 84.32,8.41 83.95,8.79 83.57,8.79 83.32,8.55 USB2.B7 ; 84.32,8.41 USB2.A7 ; 84.32,8.41 84.35,8.43 84.35,8.98 90.35,14.99 90.35,23.97 90.09,24.22 73.48,24.22 69.83,27.87 69.83,29.97 70.27,30.42 70.82,30.42 71.12,30.71 72.02,30.71 72.13,30.82
WHEEL_A: length 86.6
  Top Layer w0.254: U1.12 70.42,32.09 69.65,32.87 69.65,38.26 67.1,40.8 54.55,40.8 53.68,41.67 53.68,51.62 52.86,52.45 19.13,52.45 17.2,50.52 17.2,48.23 11.7,42.73 10.37,42.73 9.33,41.7 9.33,41.5
WHEEL_B: length 99
  Top Layer w0.254: 17.33,41.5 17.33,40.99 16.34,39.99 8.1,39.99 7.55,40.54 7.55,42.45 7.95,42.85 9.51,42.85 10.08,43.42 11.41,43.42 16.51,48.52 16.51,50.8 18.84,53.14 53.15,53.14 54.37,51.92 54.37,41.96 54.84,41.49 67.39,41.49 70.33,38.54 70.33,35.25 70.98,34.61 72.48,34.61 U1.10
WHEEL_SWITCH: length 93
  Top Layer w0.254: 11.86,41.5 11.86,40.99 11.21,40.34 8.24,40.34 7.9,40.68 7.9,42.31 8.06,42.48 9.62,42.48 10.22,43.08 11.56,43.08 16.85,48.37 16.85,50.66 18.99,52.79 53,52.79 53.76,52.03 53.77,52.03 54.03,51.78 54.03,41.81 54.69,41.15 67.24,41.15 69.99,38.4 69.99,34.42 71.02,33.4 71.97,33.4 72,33.36 U1.11
$1N4205: length 7.1
  Top Layer w0.254: R4.1 89.04,9.04 86.36,9.04 85.82,8.51 USB2.B5
$1N4231: length 10.1
  Top Layer w0.254: USB2.A5 82.82,8.94 v1(83.44,9.55) ; R5.1 87.38,10.32 v1(87.12,10.06)
  Bottom Layer w0.254: v1(83.44,9.55) 86.61,9.55 v1(87.12,10.06)
$1N6760: length 3
  Top Layer w0.254: 71.79,3.45 71.79,6.08 R7.1
$1N6829: length 18.1
  Top Layer w0.254: U2.8 77.92,13.22 78.6,13.22 79.01,12.81 79.01,10.84 76.23,8.07 71.19,8.07 70.21,7.09 69.47,7.09 69.21,6.83 69.21,4.01 69.52,3.71 LED1.2
$1N6901: length 3.2
  Top Layer w0.254: 76.74,3.45 76.74,6.2 R8.1
$1N6931: length 25.3
  Top Layer w0.254: U2.5 75.76,12.18 75.76,10.89 74.17,9.3 69.99,9.3 66.62,5.93 66.62,2.24 66.8,2.06 72.61,2.06 74.26,3.71 LED2.2
$1N6964: length 1.7
  Top Layer w0.254: U2.2 74.58,13.63 R6.2
$1N6989: length 2.2
  Top Layer w0.254: C7.2 65.49,17.53 U3.1

## Copper pours and planes (outline as drawn; the poured copper is in the pictures)
GND on Top Layer: 76.83,41.3 83.06,41.3 83.06,35.46 76.83,35.46
GND on Inner1: -2.16,56.29 -2.16,-1.75 -3.05,-2.64 95.76,-2.64 96.01,-2.9 96.01,48.54 72.39,48.54 72.01,48.16 72.01,56.03 71.88,56.16 -0.89,56.16 -1.02,56.29

## Text on the board
Top Silkscreen Layer: I2C_KB | SPI | palmanac / saim iqbal / 2025
